# EAGLE design fm-transmitter v1.1 (EAGLE 7.2.0)
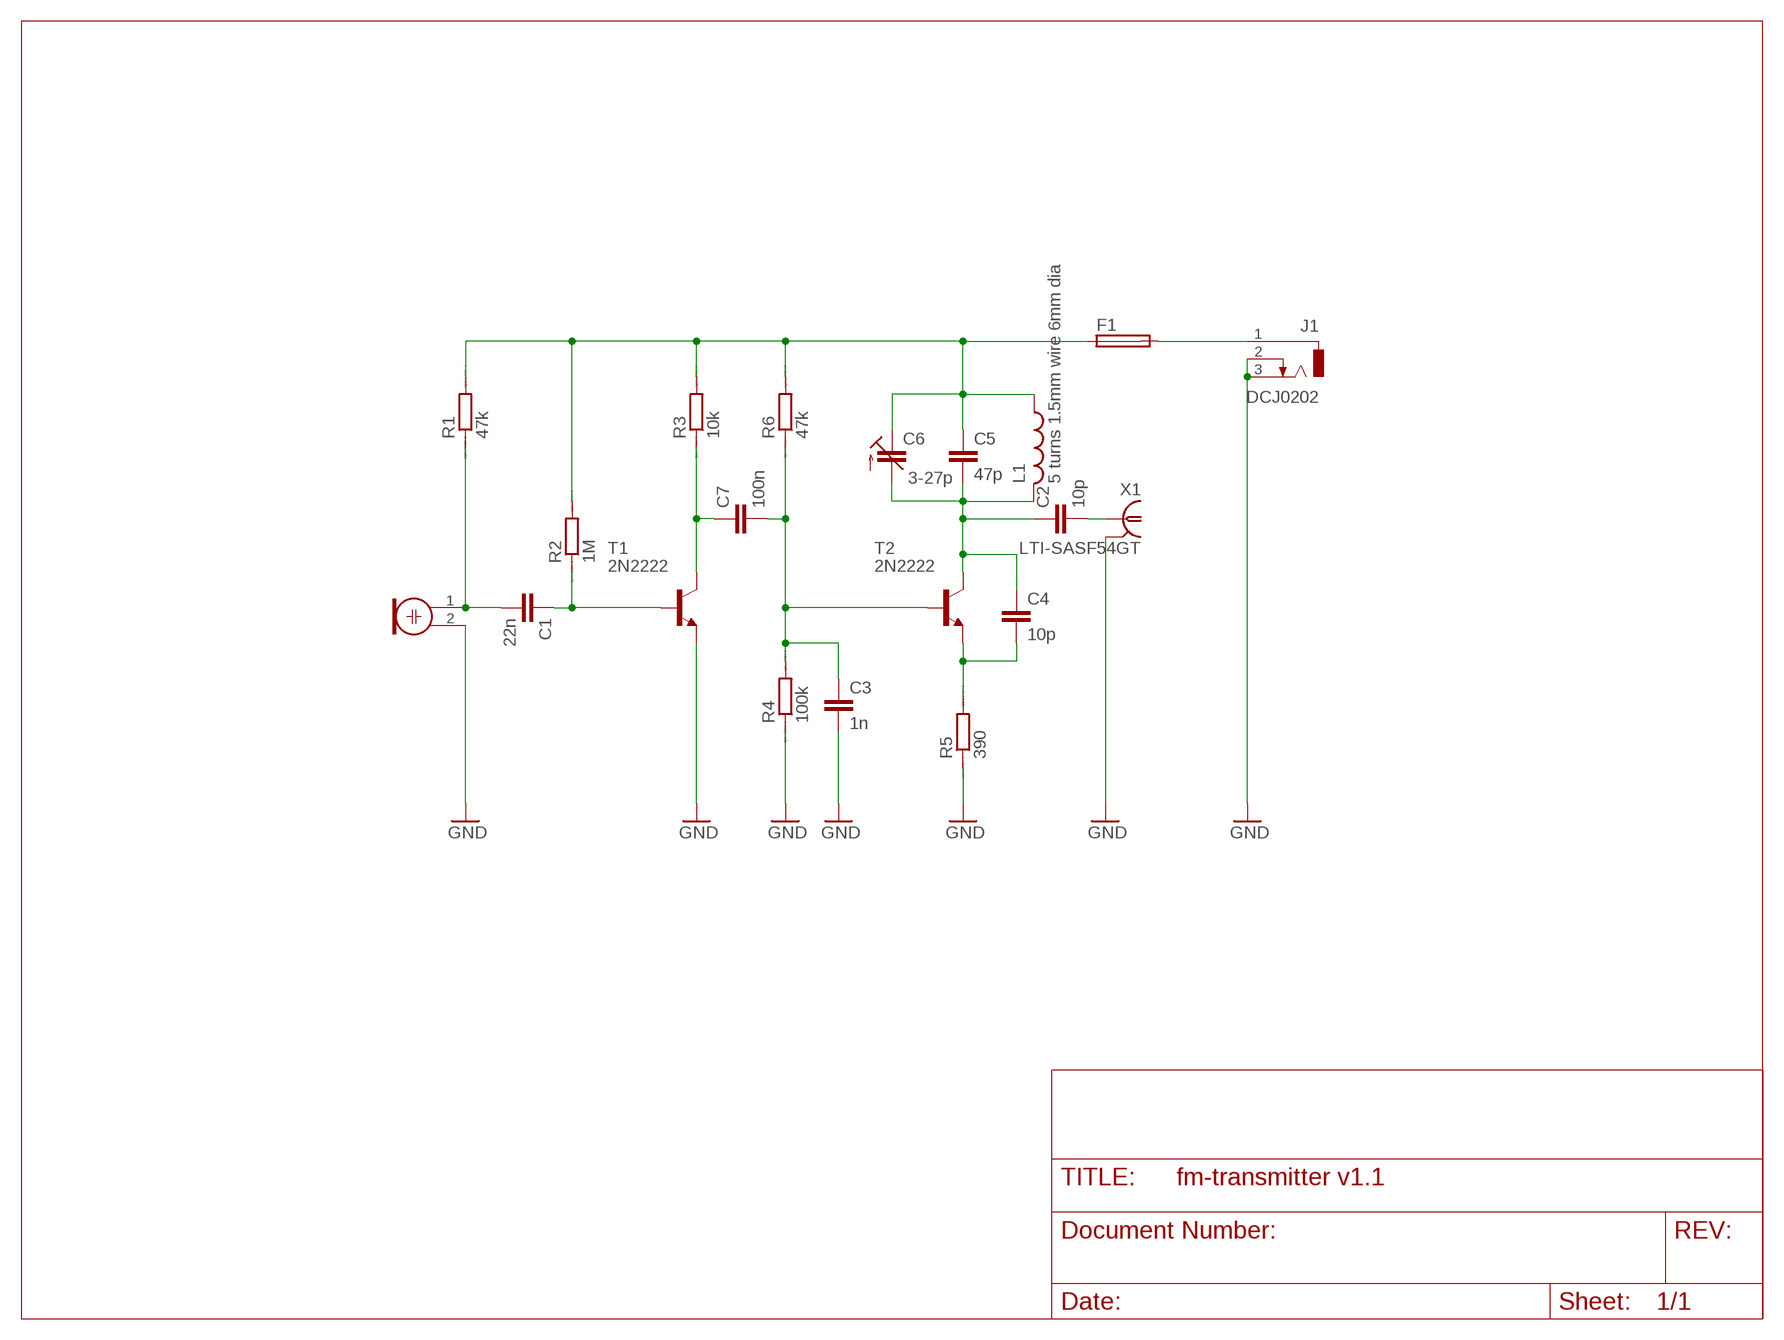
[diagram p0: schematic, sheet 1]

## Parts
C1  22n  C5/2.5  [C5B2.5]
C2  10p  C5/2.5  [C5B2.5]
C3  1n  C5/2.5  [C5B2.5]
C4  10p  C5/2.5  [C5B2.5]
C5  47p  C5/2.5  [C5B2.5]
C6  3-27p  C-TRIMM3050.504  [CTRIM3050.504]
C7  100n  C5/2.5  [C5B2.5]
F1  TE5  [TE5]
J1  DCJ0202  [DCJ0202]
L1  5 turns 1.5mm wire 6mm dia  L-US0207/7  [0207/7]
M1  ELECTRET_MICROPHON-F6050AP  [F6050AP]
R1  47k  R0207/10  [0207/10]
R2  1M  R0207/10  [0207/10]
R3  10k  R0207/10  [0207/10]
R4  100k  R0207/10  [0207/10]
R5  390  R0207/10  [0207/10]
R6  47k  R0207/10  [0207/10]
T1  2N2222  [TO18]
T2  2N2222  [TO18]
X1  LTI-SASF54GT  [LTI-SASF54GT]

## Nets
GND: C3.2 J1.2 J1.3 M1.2 R4.1 R5.1 T1.1(E) X1.2 X1.3 X1.4 X1.5
N$1: C1.2 M1.1 R1.1
N$2: C5.1 C6.1(E) F1.1 L1.1 R1.2 R2.2 R3.2 R6.2
N$3: C1.1 R2.1 T1.2(B)
N$4: C7.1 R3.1 T1.3(C)
N$5: C3.1 C7.2 R4.2 R6.1 T2.2(B)
N$6: C2.2 X1.1
N$7: C2.1 C4.1 C5.2 C6.2(A) L1.2 T2.3(C)
N$8: C4.2 R5.2 T2.1(E)
N$10: F1.2 J1.1

## Library data of the parts
C1-C5 C7 = capacitor-wima:C: CAPACITOR naming: grid - package width
C6 = resistor:C-TRIMM: Trimm capacitor
F1 = fuse:TE5: FUSE Wickmann; OC_FARNELL: unknown; OC_NEWARK: unknown
J1 = con-jack:DCJ0202: DC POWER JACK Source: DCJ0202.pdf; OC_FARNELL: unknown; OC_NEWARK: unknown
L1 = resistor:L-US: INDUCTOR, American symbol; DIAMETER: 6mm; TURNS: 5; WIRE: 1.5mm
M1 = microphon:ELECTRET_MICROPHON-: Electret Condenser Microphone
R1-R6 = eagle-ltspice:R: RESISTOR, European symbol; SPICEMODEL: NONE; SPICEPREFIX: R
T1 T2 = transistor:2N2222: NPN TRANSISTOR
X1 = con-coax:LTI-SASF54GT: SMA vertical PCB thrue hole jack Source: Lighthorse Technologies, inc. SASF54GT.pdf; OC_FARNELL: unknown; OC_NEWARK: unknown

## Board
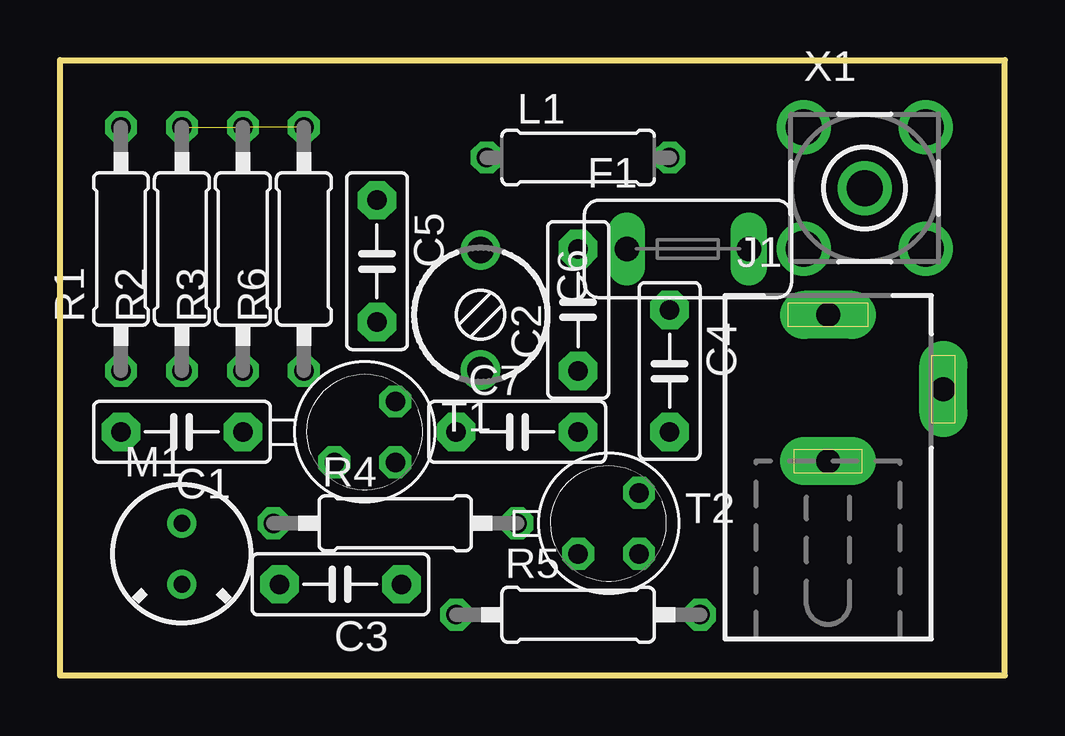
[diagram p1: board, top side]
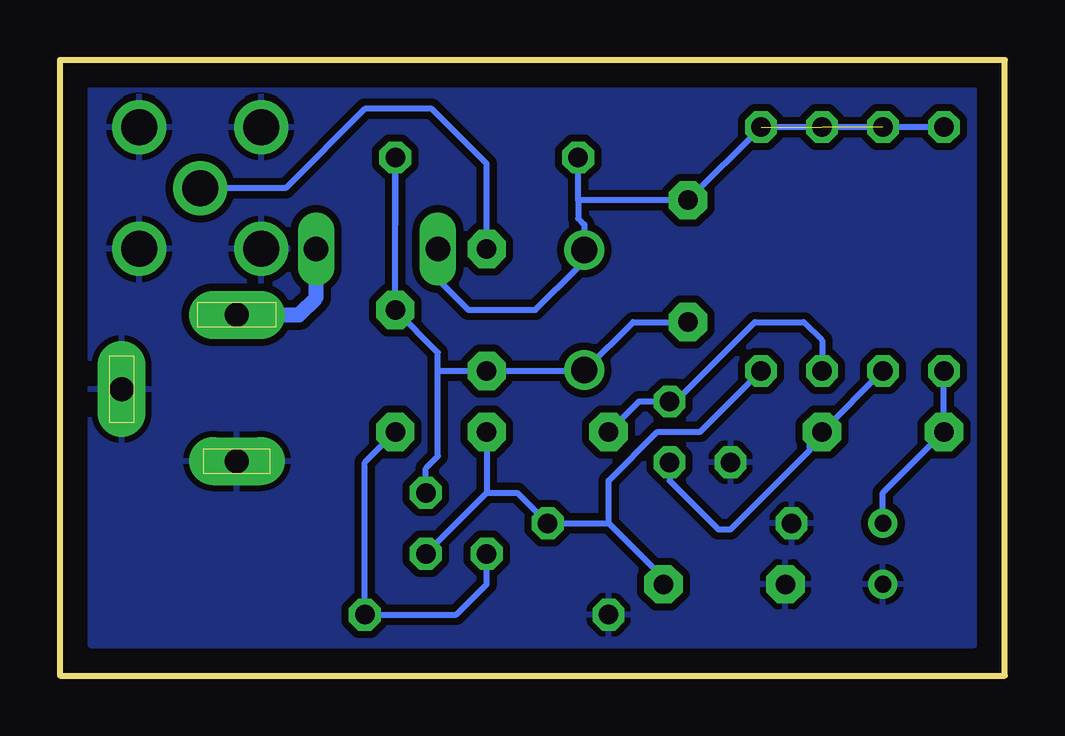
[diagram p2: board, bottom side, seen from below]

Size 39.37 x 25.65 mm. Coordinates in mm from the lower left corner, seen from the top.
Outline: 39.37,0 0,0 0,25.65 39.37,25.65 39.37,0
Copper layers (1*16): Top 0.035mm / dielectric 1.5mm / Bottom 0.035mm
Design rules "default": minimum track width 10mil, minimum drill 24mil, track to track 8mil, track to pad 8mil, pad to pad 8mil, via to via 8mil, smd to smd 8mil, copper to edge 40mil, drill to drill 8mil, minimum pad ring 10mil, minimum via ring 8mil, stop-mask expansion 4mil, vias tented up to drill 0mil, thermal gap 10mil

### Footprints (pad centres in the part's own frame; a part is rotated, then mirrored left to right if it is on the bottom)
C5B2.5 = drill 0.813 pad 1.6 octagon: 1 -2.54,0; 2 2.54,0
CTRIM3050.504 = drill 1.1: 1 -2.5,0; 2 2.5,0
TE5 = drill 1.016 long: 1 -2.54,0; 2 2.54,0
DCJ0202 = drill 1 pad 2 long: 1 0,3.1; 2 4.8,0; 3 0,-3
0207/7 = drill 0.813 octagon: 1 -3.81,0; 2 3.81,0
F6050AP = drill 0.7 pad 1.2: 1 0,1.27; 2 0,-1.27
0207/10 = drill 0.813 octagon: 1 -5.08,0; 2 5.08,0
TO18 = drill 0.813 octagon: 1 -1.27,-1.27; 2 1.27,-1.27; 3 1.27,1.27
LTI-SASF54GT = drill 1.5 pad 2.2: 1 0,0; 2 -2.54,2.54; 3 2.54,2.54; 4 2.54,-2.54; 5 -2.54,-2.54

### Placement (x,y rotation side)
C1  5.08,10.16 180 top
C2  21.59,15.24 90 top
C3  11.68,3.81 180 top
C4  25.4,12.7 270 top
C5  13.21,17.27 270 top
C6  17.53,15.24 270 top
C7  19.05,10.16 0 top
F1  26.16,17.78 0 top
J1  32,11.94 0 top
L1  21.59,21.59 0 top
M1  5.08,5.08 0 top
R1  2.54,17.78 90 top
R2  5.08,17.78 90 top
R3  7.62,17.78 90 top
R4  13.97,6.35 0 top
R5  21.59,2.54 0 top
R6  10.16,17.78 90 top
T1  12.7,10.16 0 top
T2  22.86,6.35 0 top
X1  33.53,20.32 0 top

### Tracks (layer width: path | path; a pad name or v marks a point on that pad's centre or on a via)
GND
  pour Bottom (isolate 0.305): 1.27,1.27 1.27,24.13 38.1,24.13 38.1,1.27
  pour Bottom (isolate 0.305): 2.54,2.54 2.54,1.27 36.83,1.27 36.83,2.54
N$1
  Bottom 0.254: M1.1 5.08,7.62 C1.2 R1.1
N$2  (2 unrouted)
  Bottom 0.254: R1.2 R6.2 C5.1 17.78,19.81 | 17.78,19.81 L1.1 | 17.78,19.81 17.78,19.05 17.53,18.8 C6.1 17.78,17.49 17.78,17.02 19.56,15.24 22.35,15.24 23.62,16.51 F1.1
N$3
  Bottom 0.254: R2.1 C1.1 8.13,9.65 8.13,9.4 11.43,6.1 11.94,6.1 13.97,8.13 T1.2
N$4
  Bottom 0.254: C7.1 15.24,11.43 T1.3 13.72,11.43 10.41,14.73 8.38,14.73 7.62,13.97 R3.1
N$5
  Bottom 0.254: T2.2 21.59,7.62 | 21.59,7.62 20.32,7.62 R4.2 16.51,6.35 | 16.51,6.35 13.97,3.81 C3.1 | C7.2 21.59,7.62 | 16.51,6.35 16.51,8.13 14.48,10.16 12.7,10.16 R6.1
N$6
  Bottom 0.254: C2.2 21.59,21.34 23.88,23.62 26.67,23.62 29.97,20.32 X1.1
N$7
  Bottom 0.254: T2.3 24.13,8.64 23.62,9.14 23.62,12.7 | 25.4,18.8 L1.2 C4.1 23.62,13.46 23.62,12.7 | C5.2 15.49,14.73 17.49,12.74 C6.2 17.57,12.7 C2.1 23.62,12.7
N$8
  Bottom 0.254: T2.1 21.59,3.81 22.86,2.54 R5.2 26.67,8.89 C4.2
N$9
  pour Bottom (isolate 0.305): 1.27,1.27 1.27,25.4 36.83,25.4 38.1,25.4 38.1,1.27
N$10
  Bottom 0.635: J1.1 29.41,15.04 28.7,15.75 F1.2
N$11
  pour Bottom (isolate 0.305): 1.27,24.13 1.27,24.64 38.1,24.64 38.1,24.13
N$12
  pour Bottom (isolate 0.051): 1.27,21.59 1.27,15.24 10.16,15.24 10.16,21.59

### Text on the board
bRestrict: Daniel / 2016